# EAGLE schematic miniledcube (EAGLE 5.11)
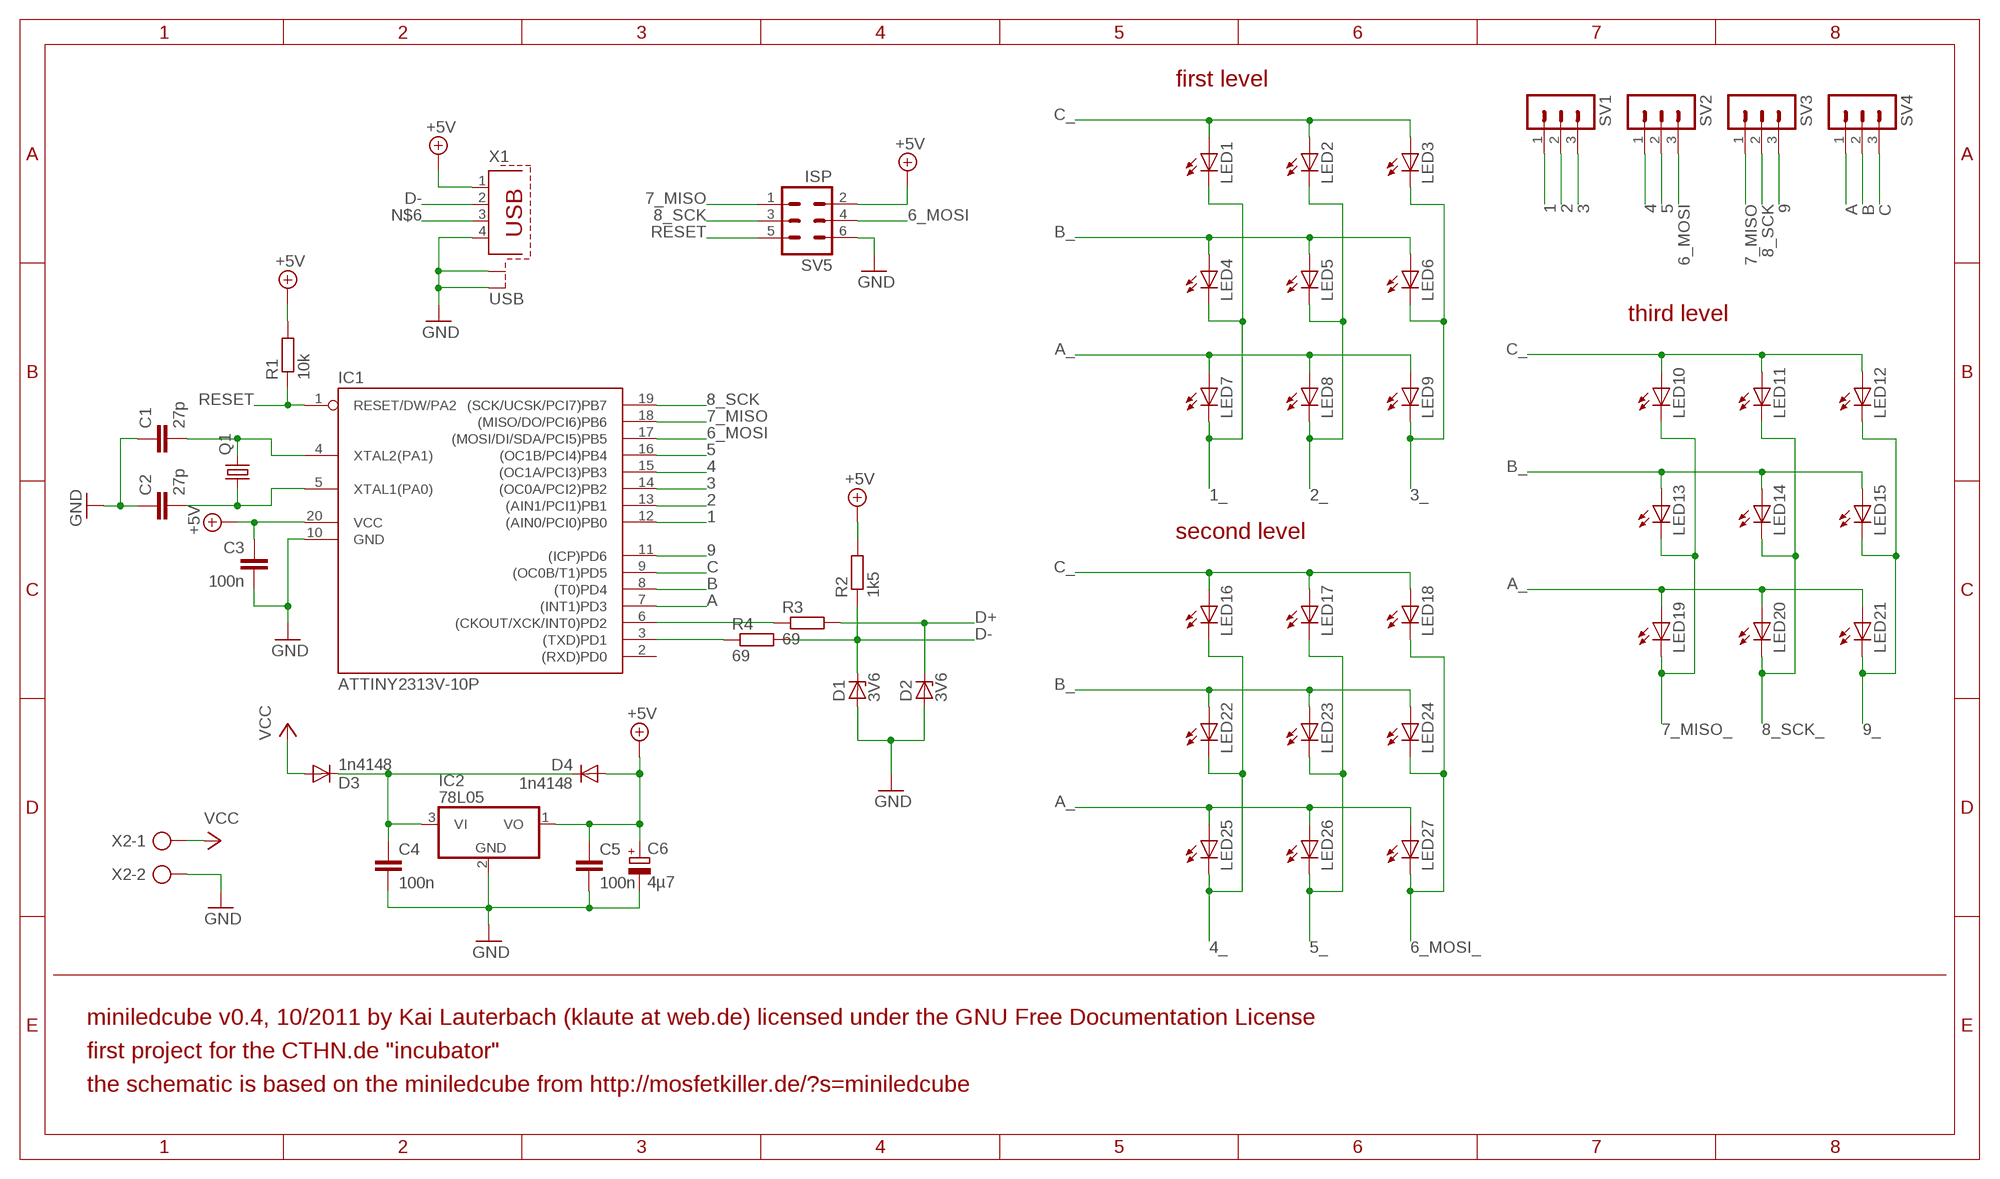
[diagram p0: schematic, sheet 1]

## Parts
C1  27p  C-EU025-024X044  [C025-024X044]
C2  27p  C-EU025-024X044  [C025-024X044]
C3  100n  C-EU025-024X044  [C025-024X044]
C4  100n  C-EU025-024X044  [C025-024X044]
C5  100n  C-EU025-024X044  [C025-024X044]
C6  4µ7  CPOL-EUE2,5-6E  [E2,5-6E]
D1  3V6  ZENER-DIODEDO34-7  [DO34Z7]
D2  3V6  ZENER-DIODEDO34-7  [DO34Z7]
D3  1n4148  1N4933  [DO41-10]
D4  1n4148  1N4933  [DO41-10]
IC1  ATTINY2313V-10P  [DIL20]
IC2  78L05  78L05Z  [TO92]
LED1  LED5MM  [LED5MM]
LED2  LED5MM  [LED5MM]
LED3  LED5MM  [LED5MM]
LED4  LED5MM  [LED5MM]
LED5  LED5MM  [LED5MM]
LED6  LED5MM  [LED5MM]
LED7  LED5MM  [LED5MM]
LED8  LED5MM  [LED5MM]
LED9  LED5MM  [LED5MM]
LED10  LED5MM  [LED5MM]
LED11  LED5MM  [LED5MM]
LED12  LED5MM  [LED5MM]
LED13  LED5MM  [LED5MM]
LED14  LED5MM  [LED5MM]
LED15  LED5MM  [LED5MM]
LED16  LED5MM  [LED5MM]
LED17  LED5MM  [LED5MM]
LED18  LED5MM  [LED5MM]
LED19  LED5MM  [LED5MM]
LED20  LED5MM  [LED5MM]
LED21  LED5MM  [LED5MM]
LED22  LED5MM  [LED5MM]
LED23  LED5MM  [LED5MM]
LED24  LED5MM  [LED5MM]
LED25  LED5MM  [LED5MM]
LED26  LED5MM  [LED5MM]
LED27  LED5MM  [LED5MM]
Q1  CRYSTALHC49S  [HC49/S]
R1  10k  R-EU_0204/2V  [0204V]
R2  1k5  R-EU_0204/2V  [0204V]
R3  69  R-EU_0204/2V  [0204V]
R4  69  R-EU_0204/2V  [0204V]
SV1  MA03-1  [MA03-1]
SV2  MA03-1  [MA03-1]
SV3  MA03-1  [MA03-1]
SV4  MA03-1  [MA03-1]
SV5  ISP  MA03-2  [MA03-2]
X1  USB  PN61729-S  [PN61729-S]
X2  AK500/2  [AK500/2]

## Nets
1: IC1.12((AIN0/PCI0)PB0) SV1.1
1_: LED1.K(C) LED4.K(C) LED7.K(C)
2: IC1.13((AIN1/PCI1)PB1) SV1.2
2_: LED2.K(C) LED5.K(C) LED8.K(C)
3: IC1.14((OC0A/PCI2)PB2) SV1.3
3_: LED3.K(C) LED6.K(C) LED9.K(C)
4: IC1.15((OC1A/PCI3)PB3) SV2.1
4_: LED16.K(C) LED22.K(C) LED25.K(C)
5: IC1.16((OC1B/PCI4)PB4) SV2.2
5_: LED17.K(C) LED23.K(C) LED26.K(C)
6_MOSI: IC1.17((MOSI/DI/SDA/PCI5)PB5) SV2.3 SV5.4
6_MOSI_: LED18.K(C) LED24.K(C) LED27.K(C)
7_MISO: IC1.18((MISO/DO/PCI6)PB6) SV3.1 SV5.1
7_MISO_: LED10.K(C) LED13.K(C) LED19.K(C)
8_SCK: IC1.19((SCK/UCSK/PCI7)PB7) SV3.2 SV5.3
8_SCK_: LED11.K(C) LED14.K(C) LED20.K(C)
9: IC1.11((ICP)PD6) SV3.3
9_: LED12.K(C) LED15.K(C) LED21.K(C)
+5V: C3.1 C5.1 C6.+ D4.A IC1.20(VCC) IC2.1(VO) R1.2 R2.2 SV5.2 X1.1
A: IC1.7((INT1)PD3) SV4.1
A_: LED7.A LED8.A LED9.A LED19.A LED20.A LED21.A LED25.A LED26.A LED27.A
B: IC1.8((T0)PD4) SV4.2
B_: LED4.A LED5.A LED6.A LED13.A LED14.A LED15.A LED22.A LED23.A LED24.A
C: IC1.9((OC0B/T1)PD5) SV4.3
C_: LED1.A LED2.A LED3.A LED10.A LED11.A LED12.A LED16.A LED17.A LED18.A
D+: D2.C R3.2
D-: D1.C R2.1 R4.2 X1.2
GND: C1.1 C2.1 C3.2 C4.2 C5.2 C6.- D1.A D2.A IC1.10(GND) IC2.2(GND) SV5.6 X1.4 X1.S1 X1.S2 X2.2
N$1: C1.2 IC1.4(XTAL2(PA1)) Q1.2
N$2: C2.2 IC1.5(XTAL1(PA0)) Q1.1
N$3: IC1.6((CKOUT/XCK/INT0)PD2) R3.1
N$4: IC1.3((TXD)PD1) R4.1
N$5: C4.1 D3.C D4.C IC2.3(VI)
N$6: X1.3
RESET: IC1.1(RESET/DW/PA2) R1.1 SV5.5
VCC: D3.A X2.1
Unconnected: IC1.2((RXD)PD0)

## Notes on the sheet
- first level
- third level
- second level
- miniledcube v0.4, 10/2011 by Kai Lauterbach (klaute at web.de) licensed under the GNU Free Documentation License
- first project for the CTHN.de "incubator"
- the schematic is based on the miniledcube from http://mosfetkiller.de/?s=miniledcube

## Library data of the parts
C1-C5 = rcl:C-EU: CAPACITOR, European symbol
C6 = rcl:CPOL-EU: POLARIZED CAPACITOR, European symbol
D1 D2 = diode:ZENER-DIODE: Z-Diode
D3 D4 = diode:1N4933: DIODE fast recovery rectifier, 1A
IC1 = avr:ATTINY2313: MICROCONTROLLER 2 Kbytes FLASH 128 bytes SRAM 128 bytes EEPROM USART USI
IC2 = linear:78*: Positive VOLTAGE REGULATOR Source: http://cache.national.com/ds/LM/LM78L05.pdf http://www.fairchildsemi.com/ds/LM/LM7805.pdf
LED1-LED27 = led:LED: LED OSRAM: - CHIPLED LG R971, LG N971, LY N971, LG Q971, LY Q971, LO R971, LY R971 LH N974, LH R974 LS Q976, LO Q976, LY Q976 LO Q996 - Hyper CHIPLED LW Q18S LB Q993, LB Q99A, LB R99A - SideLED LS A670, LO A670, LY A670, LG A670, LP A670 LB A673, LV A673, LT A673, LW A673 LH A674 LY A675 LS A676, LA A676, LO A676, LY A676, LW A676 LS A679, LY A679, LG A679 - Hyper Micro SIDELED® LS Y876, LA Y876, LO Y876, LY Y876 LT Y87S - SmartLED LW L88C, LW L88S LB L89C, LB L89S, LG L890 LS L89K, LO L89K, LY L89K LS L896, LA L896, LO L896, LY L896 - TOPLED LS T670, LO T670, LY T670, LG T670, LP T670 LSG T670, LSP T670, LSY T670, LOP T670, LYG T670 LG T671, LOG T671, LSG T671 LB T673, LV T673, LT T673, LW T673 LH T674 LS T676, LA T676, LO T676, LY T676, LB T676, LH T676, LSB T676, LW T676 LB T67C, LV T67C, LT T67C, LS T67K, LO T67K, LY T67K, LW E67C LS E67B, LA E67B, LO E67B, LY E67B, LB E67C, LV E67C, LT E67C LW T67C LS T679, LY T679, LG T679 LS T770, LO T770, LY T770, LG T770, LP T770 LB T773, LV T773, LT T773, LW T773 LH T774 LS E675, LA E675, LY E675, LS T675 LS T776, LA T776, LO T776, LY T776, LB T776 LHGB T686 LT T68C, LB T68C - Hyper Mini TOPLED® LB M676 - Mini TOPLED Santana® LG M470 LS M47K, LO M47K, LY M47K Source: http://www.osram.convergy.de LUXEON: - LUMILED® LXK2-PW12-R00, LXK2-PW12-S00, LXK2-PW14-U00, LXK2-PW14-V00 LXK2-PM12-R00, LXK2-PM12-S00, LXK2-PM14-U00 LXK2-PE12-Q00, LXK2-PE12-R00, LXK2-PE12-S00, LXK2-PE14-T00, LXK2-PE14-U00 LXK2-PB12-K00, LXK2-PB12-L00, LXK2-PB12-M00, LXK2-PB14-N00, LXK2-PB14-P00, LXK2-PB14-Q00 LXK2-PR12-L00, LXK2-PR12-M00, LXK2-PR14-Q00, LXK2-PR14-R00 LXK2-PD12-Q00, LXK2-PD12-R00, LXK2-PD12-S00 LXK2-PH12-R00, LXK2-PH12-S00 LXK2-PL12-P00, LXK2-PL12-Q00, LXK2-PL12-R00 Source: www.luxeon.com KINGBRIGHT: KA-3528ASYC Source: www.kingbright.com
Q1 = crystal:CRYSTAL: CRYSTAL
R1-R4 = rcl:R-EU_: RESISTOR, European symbol
SV1-SV4 = con-lstb:MA03-1: PIN HEADER; OC_FARNELL: unknown; OC_NEWARK: unknown
SV5 = con-lstb:MA03-2: PIN HEADER; OC_FARNELL: unknown; OC_NEWARK: unknown
X1 = con-berg:PN61729-S: BERG USB connector; OC_FARNELL: unknown; OC_NEWARK: unknown
X2 = con-ptr500:AK500/2: CONNECTOR; OC_FARNELL: unknown; OC_NEWARK: unknown